# EAGLE design A20_V3_90_Deg_Adapter (EAGLE 9.6.2)
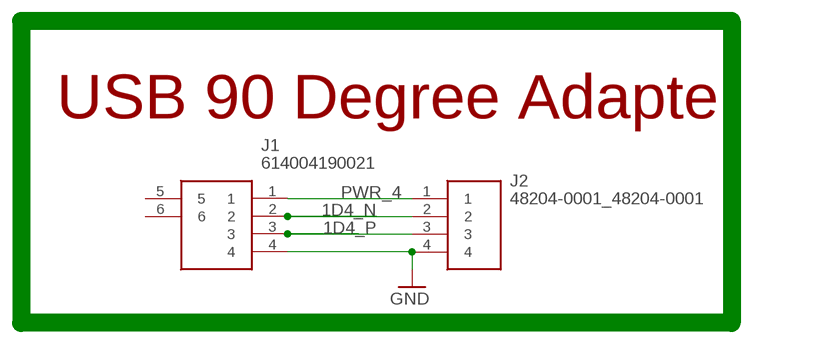
[diagram p0: schematic, sheet 1]

## Parts
J1  614004190021  [USB-2.0-TYPE-A]
J2  48204-0001_48204-0001  [48204-0001_48204-0001_1]

## Nets
1D4_N [USB]: J1.2 J2.2
1D4_P [USB]: J1.3 J2.3
GND [pwr]: J1.4 J2.4
PWR_4: J1.1 J2.1
Unconnected: J1.5 J1.6

## Notes on the sheet
- USB 90 Degree Adapter

## Library data of the parts
J1 = 614004190021:614004190021: USB Connectors WR-COM USB Type A THT Horizontal Source: Datasheet <http://katalog.we-online.de/em/datasheet/614004190021.pdf>; DESCRIPTION: USB Connectors WR-COM USB Type A THT Horizontal; HEIGHT: mm; MANUFACTURER_NAME: Wurth Elektronik; MANUFACTURER_PART_NUMBER: 614004190021; MOUSER_PART_NUMBER: 710-614004190021; MOUSER_PRICE-STOCK: https://www.mouser.com/Search/Refine.aspx?Keyword=710-614004190021; RS_PART_NUMBER: 1622149; RS_PRICE-STOCK: http://uk.rs-online.com/web/p/products/1622149
J2 = A20_V3_PATCH:48204-0001_48204-0001: USB A Upright PCB Receptacle Right Angle Source: Datasheet <http://www.molex.com/webdocs/datasheets/pdf/en-us/0482040001_IO_CONNECTORS.pdf>; ALLIED_NUMBER: 70364018; ALLIED_PRICE-STOCK: http://www.alliedelec.com/molex-incorporated-48204-0001/70364018/; DESCRIPTION: USB A Upright PCB Receptacle Right Angle; HEIGHT: mm; MANUFACTURER_NAME: Molex; MANUFACTURER_PART_NUMBER: 48204-0001; MOUSER_PART_NUMBER: 538-48204-0001; MOUSER_PRICE-STOCK: https://www.mouser.com/Search/Refine.aspx?Keyword=538-48204-0001; RS_PART_NUMBER: 8006863; RS_PRICE-STOCK: http://uk.rs-online.com/web/p/products/8006863

## Net classes
2 HDMI//SATA: width 0.102 mm, drill 0.2 mm, clearance 0.152 mm
3 USB: width 0.114 mm, drill 0.2 mm, clearance 0.102 mm

## Board
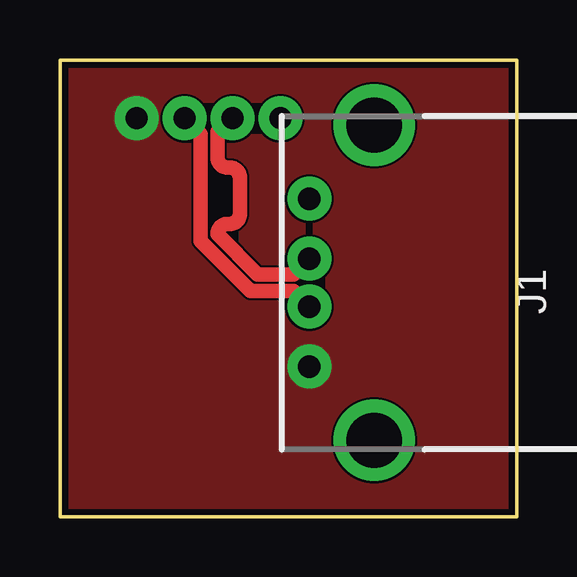
[diagram p1: board, top side]
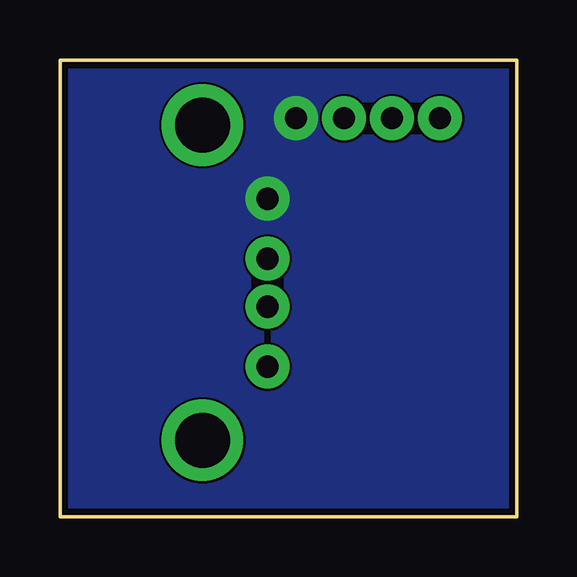
[diagram p2: board, bottom side, seen from below]

Size 19.05 x 19.05 mm. Coordinates in mm from the lower left corner, seen from the top.
Outline: 0,19.05 0,0 19.05,0 19.05,19.05 0,19.05
Copper layers (1*16): Top 0.035mm / dielectric 0.2mm / Bottom 0.035mm
Design rules "default *": minimum track width 4mil, minimum drill 0.2mm, track to track 3.5mil, track to pad 3.5mil, pad to pad 3.5mil, via to via 3.5mil, smd to smd 3.5mil, copper to edge 10mil, drill to drill 12mil, minimum pad ring 18mil, minimum via ring 4mil, stop-mask expansion 2mil, vias tented up to drill 25mil, thermal gap 10mil

### Footprints (pad centres in the part's own frame; a part is rotated, then mirrored left to right if it is on the bottom)
USB-2.0-TYPE-A = drill 0.92 pad 1.5: 1 -3.5,13.01; 2 -1,13.01; 3 1,13.01; 4 3.5,13.01 | drill 2.3 pad 3.4: 5 -6.57,10.3; 6 6.57,10.3
48204-0001_48204-0001_1 = drill 0.92 pad 1.42: 1 3.325,-0.921; 2 3.325,-2.921; 3 3.325,-4.921; 4 3.325,-6.921

### Placement (x,y rotation side)
J1  23.41,9.76 90 top
J2  2.28,13.29 90 top

### Tracks (layer width: path | path; a pad name or v marks a point on that pad's centre or on a via)
1D4_N
  Top 0.6: J1.2 9.75,9.41 7.95,9.41 5.87,11.5 5.87,15.95 J2.2
1D4_P
  Top 0.6: J1.3 9.75,10.11 8.24,10.11 6.57,11.79 arc-90 6.99,12.21 7.08,12.21 arc90 7.5,12.64 7.5,14.14 arc90 7.08,14.56 6.99,14.56 arc-90 6.57,14.99 6.57,16.05 7.13,16.62 J2.3
GND
  pour Bottom (no thermals): -2.01,21.32 -2.01,-2.1 22.01,-2.1 22.01,21.32
PWR_4
  pour Top (no thermals): -1.01,19.75 -1.01,-1.1 21.08,-1.1 21.08,19.83 -0.86,19.83